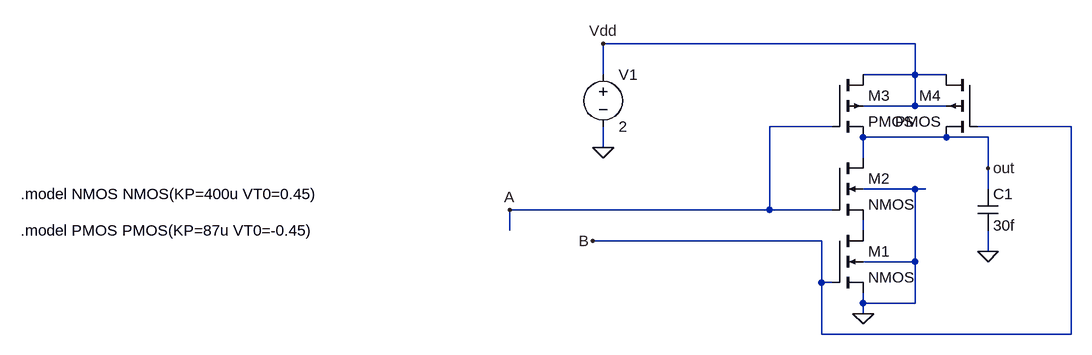
[diagram p0: schematic NAND2_symbol.asc]
NAND2_symbol.asc, the LTspice schematic file:
Version 4
SHEET 1 1156 680
WIRE 912 32 432 32
WIRE 432 80 432 32
WIRE 912 80 912 32
WIRE 912 80 832 80
WIRE 960 80 912 80
WIRE 912 128 912 80
WIRE 912 128 832 128
WIRE 960 128 912 128
WIRE 784 160 688 160
WIRE 1152 160 1008 160
WIRE 960 176 832 176
WIRE 1024 176 960 176
WIRE 432 192 432 160
WIRE 832 208 832 176
WIRE 1024 224 1024 176
WIRE 912 256 832 256
WIRE 928 256 912 256
WIRE 1024 256 1024 224
WIRE 688 288 688 160
WIRE 688 288 288 288
WIRE 784 288 688 288
WIRE 288 320 288 288
WIRE 832 320 832 304
WIRE 768 336 416 336
WIRE 1024 352 1024 320
WIRE 912 368 912 256
WIRE 912 368 832 368
WIRE 768 400 768 336
WIRE 784 400 768 400
WIRE 832 432 832 416
WIRE 912 432 912 368
WIRE 912 432 832 432
WIRE 832 448 832 432
WIRE 768 480 768 400
WIRE 1152 480 1152 160
WIRE 1152 480 768 480
FLAG 432 192 0
FLAG 1024 352 0
FLAG 832 448 0
FLAG 1024 224 out
FLAG 288 288 A
FLAG 416 336 B
FLAG 432 32 Vdd
SYMBOL nmos4 784 320 R0
SYMATTR InstName M1
SYMATTR Value2 l=0.15u w=1.24u
SYMBOL voltage 432 64 R0
WINDOW 123 0 0 Left 0
WINDOW 39 0 0 Left 0
SYMATTR InstName V1
SYMATTR Value 2
SYMBOL cap 1008 256 R0
SYMATTR InstName C1
SYMATTR Value 30f
SYMBOL nmos4 784 208 R0
SYMATTR InstName M2
SYMATTR Value2 l=0.15u w=1.24u
SYMBOL pmos4 784 80 R0
SYMATTR InstName M3
SYMATTR Value2 l=0.15u w=2.85u
SYMBOL pmos4 1008 80 M0
SYMATTR InstName M4
SYMATTR Value2 l=0.15u w=2.85u
TEXT -464 264 Left 2 !.model NMOS NMOS(KP=400u VT0=0.45)
TEXT -464 320 Left 2 !.model PMOS PMOS(KP=87u VT0=-0.45)

The netlist it stands for:
* NAND2_symbol.asc
M1 N001 B 0 0 NMOS l=0.15u w=1.24u
V1 Vdd 0 2
C1 out 0 30f
M2 out A N001 0 NMOS l=0.15u w=1.24u
M3 Vdd A out Vdd PMOS l=0.15u w=2.85u
M4 Vdd B out Vdd PMOS l=0.15u w=2.85u
.model NMOS NMOS
.model PMOS PMOS
.lib standard.mos
.model NMOS NMOS(KP=400u VT0=0.45)
.model PMOS PMOS(KP=87u VT0=-0.45)
.backanno
.end